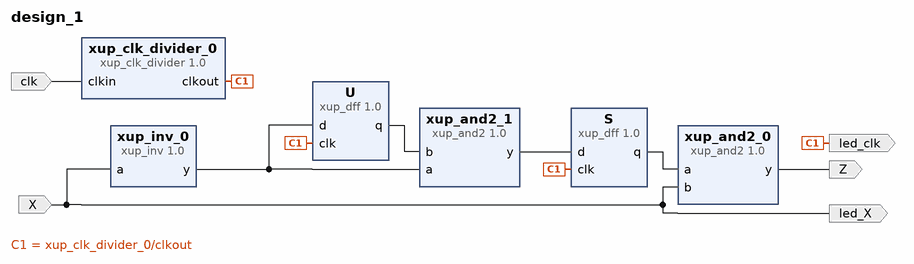
[diagram p0: block diagram of the top level]
# Vivado block design design_1, xc7a35tcpg236-1, Vivado 2023.1
create_bd_design design_1

create_bd_port -dir I X
create_bd_port -dir I clk
create_bd_port -dir O Z
create_bd_port -dir O led_clk
create_bd_port -dir O led_X

create_bd_cell -type ip -vlnv xilinx.com:XUP:xup_dff:1.0 U
create_bd_cell -type ip -vlnv xilinx.com:XUP:xup_clk_divider:1.0 xup_clk_divider_0
set_property -dict {CONFIG.SIZE 200000000} [get_bd_cells xup_clk_divider_0]
create_bd_cell -type ip -vlnv xilinx.com:XUP:xup_dff:1.0 S
create_bd_cell -type ip -vlnv xilinx.com:XUP:xup_and2:1.0 xup_and2_0
create_bd_cell -type ip -vlnv xilinx.com:XUP:xup_inv:1.0 xup_inv_0
create_bd_cell -type ip -vlnv xilinx.com:XUP:xup_and2:1.0 xup_and2_1

# ---- connections ----

connect_bd_net [get_bd_pins S/q] [get_bd_pins xup_and2_0/a]
connect_bd_net -net U [get_bd_pins xup_clk_divider_0/clkout] [get_bd_pins U/clk] [get_bd_pins S/clk] [get_bd_ports led_clk]
connect_bd_net [get_bd_pins U/q] [get_bd_pins xup_and2_1/b]
connect_bd_net [get_bd_ports X] [get_bd_pins xup_and2_0/b] [get_bd_pins xup_inv_0/a] [get_bd_ports led_X]
connect_bd_net [get_bd_ports clk] [get_bd_pins xup_clk_divider_0/clkin]
connect_bd_net [get_bd_pins xup_and2_0/y] [get_bd_ports Z]
connect_bd_net [get_bd_pins xup_and2_1/y] [get_bd_pins S/d]
connect_bd_net [get_bd_pins xup_inv_0/y] [get_bd_pins U/d] [get_bd_pins xup_and2_1/a]

validate_bd_design
save_bd_design
